# Altium schematic sheet Sheet1.SchDoc
size A
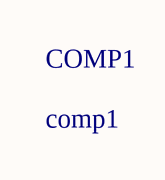
[diagram p0: Sheet1.SchDoc]

## Parts
COMP1  comp1

## Library data of the parts
COMP1 = Component_1